# Altium schematic sheet MCH_FPGA_Power.SchDoc: Metlino
size 420 x 297 mm; CheckedBy: P.Kulik,T.Przywozki,W.Ruclo; Author: G.Kasprowicz; CompanyName: WUT ISE; DrawnBy: G.Kasprowicz; Organization: WUT ISE; Address1: PW ISE; Address2: Nowowiejska 15/19 00-665 Warsaw; Address3: gkasprow@gmail.com; DocumentNumber: 9; Revision: 2; SheetNumber: 9; SheetTotal: 29; ModifiedBy: -; CheckedDate: -; Title2: FPGA power rails; DivGrp: WUT ISE; Designer: G.Kasprowicz; ModifiedDate: -; ProjectName: Sensor Box
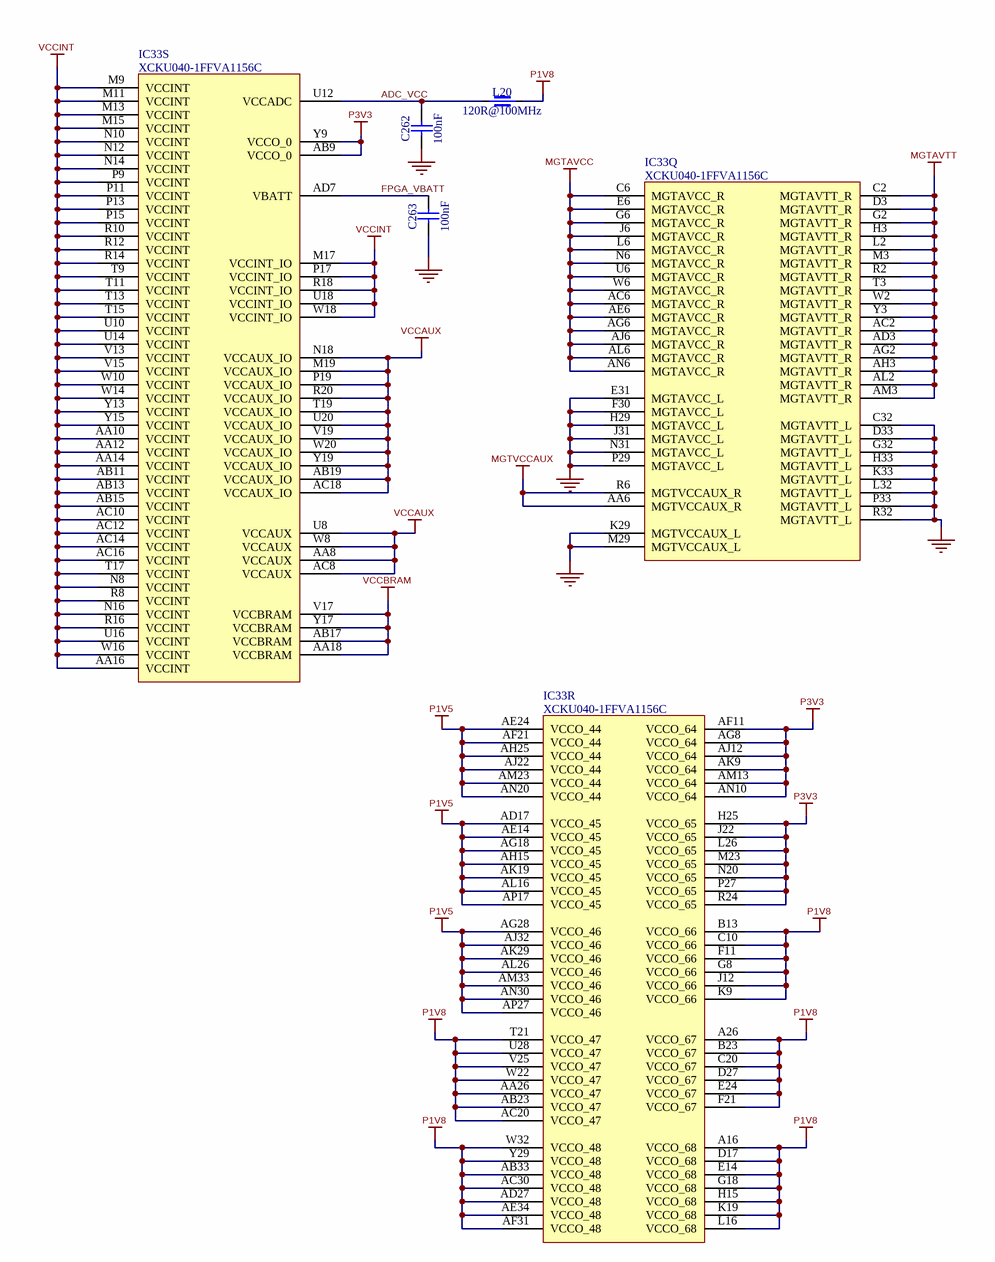
[diagram p0: MCH_FPGA_Power.SchDoc]

## Parts
C262  100nF  [CAPC0603X33N]
C263  100nF  [CAPC0603X33N]
IC33  XCKU040-1FFVA1156C  [BGA1156C100P34X34_3500X3500X350]  (parts Q,R,S of 22)
L20  120R@100MHz  [INDC1005X55N]

## Nets
GND: C262.1 C263.1 IC33.C32(MGTAVTT_L) IC33.D33(MGTAVTT_L) IC33.E31(MGTAVCC_L) IC33.F30(MGTAVCC_L) IC33.G32(MGTAVTT_L) IC33.H29(MGTAVCC_L) IC33.H33(MGTAVTT_L) IC33.J31(MGTAVCC_L) IC33.K29(MGTVCCAUX_L) IC33.K33(MGTAVTT_L) IC33.L32(MGTAVTT_L) IC33.M29(MGTVCCAUX_L) IC33.N31(MGTAVCC_L) IC33.P29(MGTAVCC_L) IC33.P33(MGTAVTT_L) IC33.R32(MGTAVTT_L)
MGTAVCC: IC33.AC6(MGTAVCC_R) IC33.AE6(MGTAVCC_R) IC33.AG6(MGTAVCC_R) IC33.AJ6(MGTAVCC_R) IC33.AL6(MGTAVCC_R) IC33.AN6(MGTAVCC_R) IC33.C6(MGTAVCC_R) IC33.E6(MGTAVCC_R) IC33.G6(MGTAVCC_R) IC33.J6(MGTAVCC_R) IC33.L6(MGTAVCC_R) IC33.N6(MGTAVCC_R) IC33.U6(MGTAVCC_R) IC33.W6(MGTAVCC_R)
MGTAVTT: IC33.AC2(MGTAVTT_R) IC33.AD3(MGTAVTT_R) IC33.AG2(MGTAVTT_R) IC33.AH3(MGTAVTT_R) IC33.AL2(MGTAVTT_R) IC33.AM3(MGTAVTT_R) IC33.C2(MGTAVTT_R) IC33.D3(MGTAVTT_R) IC33.G2(MGTAVTT_R) IC33.H3(MGTAVTT_R) IC33.L2(MGTAVTT_R) IC33.M3(MGTAVTT_R) IC33.R2(MGTAVTT_R) IC33.T3(MGTAVTT_R) IC33.W2(MGTAVTT_R) IC33.Y3(MGTAVTT_R)
MGTVCCAUX: IC33.AA6(MGTVCCAUX_R) IC33.R6(MGTVCCAUX_R)
P1V5: IC33.AD17(VCCO_45) IC33.AE14(VCCO_45) IC33.AE24(VCCO_44) IC33.AF21(VCCO_44) IC33.AG18(VCCO_45) IC33.AG28(VCCO_46) IC33.AH15(VCCO_45) IC33.AH25(VCCO_44) IC33.AJ22(VCCO_44) IC33.AJ32(VCCO_46) IC33.AK19(VCCO_45) IC33.AK29(VCCO_46) IC33.AL16(VCCO_45) IC33.AL26(VCCO_46) IC33.AM23(VCCO_44) IC33.AM33(VCCO_46) IC33.AN20(VCCO_44) IC33.AN30(VCCO_46) IC33.AP17(VCCO_45) IC33.AP27(VCCO_46)
P1V8: IC33.A16(VCCO_68) IC33.A26(VCCO_67) IC33.AA26(VCCO_47) IC33.AB23(VCCO_47) IC33.AB33(VCCO_48) IC33.AC20(VCCO_47) IC33.AC30(VCCO_48) IC33.AD27(VCCO_48) IC33.AE34(VCCO_48) IC33.AF31(VCCO_48) IC33.B13(VCCO_66) IC33.B23(VCCO_67) IC33.C10(VCCO_66) IC33.C20(VCCO_67) IC33.D17(VCCO_68) IC33.D27(VCCO_67) IC33.E14(VCCO_68) IC33.E24(VCCO_67) IC33.F11(VCCO_66) IC33.F21(VCCO_67) IC33.G8(VCCO_66) IC33.G18(VCCO_68) IC33.H15(VCCO_68) IC33.J12(VCCO_66) IC33.K9(VCCO_66) IC33.K19(VCCO_68) IC33.L16(VCCO_68) IC33.T21(VCCO_47) IC33.U28(VCCO_47) IC33.V25(VCCO_47) IC33.W22(VCCO_47) IC33.W32(VCCO_48) IC33.Y29(VCCO_48) L20.2
P3V3: IC33.AB9(VCCO_0) IC33.AF11(VCCO_64) IC33.AG8(VCCO_64) IC33.AJ12(VCCO_64) IC33.AK9(VCCO_64) IC33.AM13(VCCO_64) IC33.AN10(VCCO_64) IC33.H25(VCCO_65) IC33.J22(VCCO_65) IC33.L26(VCCO_65) IC33.M23(VCCO_65) IC33.N20(VCCO_65) IC33.P27(VCCO_65) IC33.R24(VCCO_65) IC33.Y9(VCCO_0)
VCCAUX: IC33.AA8(VCCAUX) IC33.AB19(VCCAUX_IO) IC33.AC8(VCCAUX) IC33.AC18(VCCAUX_IO) IC33.M19(VCCAUX_IO) IC33.N18(VCCAUX_IO) IC33.P19(VCCAUX_IO) IC33.R20(VCCAUX_IO) IC33.T19(VCCAUX_IO) IC33.U8(VCCAUX) IC33.U20(VCCAUX_IO) IC33.V19(VCCAUX_IO) IC33.W8(VCCAUX) IC33.W20(VCCAUX_IO) IC33.Y19(VCCAUX_IO)
VCCBRAM: IC33.AA18(VCCBRAM) IC33.AB17(VCCBRAM) IC33.V17(VCCBRAM) IC33.Y17(VCCBRAM)
VCCINT: IC33.AA10(VCCINT) IC33.AA12(VCCINT) IC33.AA14(VCCINT) IC33.AA16(VCCINT) IC33.AB11(VCCINT) IC33.AB13(VCCINT) IC33.AB15(VCCINT) IC33.AC10(VCCINT) IC33.AC12(VCCINT) IC33.AC14(VCCINT) IC33.AC16(VCCINT) IC33.M9(VCCINT) IC33.M11(VCCINT) IC33.M13(VCCINT) IC33.M15(VCCINT) IC33.M17(VCCINT_IO) IC33.N8(VCCINT) IC33.N10(VCCINT) IC33.N12(VCCINT) IC33.N14(VCCINT) IC33.N16(VCCINT) IC33.P9(VCCINT) IC33.P11(VCCINT) IC33.P13(VCCINT) IC33.P15(VCCINT) IC33.P17(VCCINT_IO) IC33.R8(VCCINT) IC33.R10(VCCINT) IC33.R12(VCCINT) IC33.R14(VCCINT) IC33.R16(VCCINT) IC33.R18(VCCINT_IO) IC33.T9(VCCINT) IC33.T11(VCCINT) IC33.T13(VCCINT) IC33.T15(VCCINT) IC33.T17(VCCINT) IC33.U10(VCCINT) IC33.U14(VCCINT) IC33.U16(VCCINT) IC33.U18(VCCINT_IO) IC33.V13(VCCINT) IC33.V15(VCCINT) IC33.W10(VCCINT) IC33.W14(VCCINT) IC33.W16(VCCINT) IC33.W18(VCCINT_IO) IC33.Y13(VCCINT) IC33.Y15(VCCINT)
ADC_VCC: C262.2 IC33.U12(VCCADC) L20.1
FPGA_VBATT: C263.2 IC33.AD7(VBATT)

## Notes on the sheet
- Project/Equipment
- Document
- Designer
- Drawn by
- Check.by
- Copyright WUT ISE 2018.
  This documentation describes Open Hardware and is licensed under the CERN OHL v.1.1. You may redistribute and modify this documentation under the terms of the CERN OHL v.1.1. (http://ohwr.org/CERNOHL). This documentation is distributed WITHOUT ANY EXPRESS OR IMPLIED WARRANTY, INCLUDING OF MERCHANTABILITY, SATISFACTORY QUALITY AND FITNESS FOR A PARTICULAR PURPOSE. Please see the CERN OHL v.1.1 for applicable conditions.
- Contact
- File
- Last Mod.
- Print Date
- Sheet
- Size
- A3
- of
- Rev

## Library data of the parts
C262 C263 = CC0201_100NF_6.3V_10%_X5R: Non-polarised capacitor; Manufacturer: GENERIC; Part Description: SMD Multilayer Chip Ceramic Capacitor; Manufacturer1 Part Number: 02016D104KAT2A; Tolerance: ±10%; Voltage: 6.3V; TC: X5R; Manufacturer Part Number: CC0201_100NF_6.3V_10%_X5R; Part Number: CC0201_100NF_6.3V_10%_X5R; Value: 100nF; Component Kind: Standard; Component Type: Standard; Pin Count: 2; Status: Not Recommended; Case: 0201; Mounted: Yes; Socket: No; SMD: Yes; Sense: No; Manufacturer1 Example: AVX; Manufacturer1 ComponentHeight: 0.33mm; HelpURL: \\cern.ch\dfs\Applications\Altium\Datasheets\CC0201_X5R_AVX.pdf; Author: CERN DEM JLC; CreateDate: 03.12.2007; LatestRevisionDate: 03.12.2007
IC33 = XCKU040-1FFVA1156C: Kintex UltraScale FPGA, 520 I/O, 530K Cells, 1156-Ball BGA, Speed Grade 1, Commercial Grade; Manufacturer: XILINX; Part Description: Kintex UltraScale, 40 DLL I/O, 416 HP I/O, 104 HR I/O, 1156-Pin BGA, Speed Grade 1, Commercial Grade; PressFit: No; Bonding: No; PackageDescription: BGA, 1.00mm Pitch, Square; 1156 Pin, 34 Columns X 34 Rows, Body 35.00mm X 35.00mm X 3.50mm H, IPC Medium Density; Part Number: XCKU040-1FFVA1156C; Component Kind: Standard; Component Type: Standard; Device: XCKU040-1FFVA1156C; Manufacturer Part Number: XCKU040-1FFVA1156C; Pin Count: 1156; Case: BGA1156; Mounted: Yes; Socket: No; SMD: Yes; Sense: No; ComponentHeight: 3.5mm; HelpURL: \\cern.ch\dfs\Applications\Altium\Datasheets\XCKU040-1FFVA1156C.pdf; ComponentLink1URL: \\cern.ch\dfs\Applications\Altium\Datasheets\XCKU040-1FFVA1156C_Package-Pinout.pdf; ComponentLink1Description: Package/Pinout; Author: CERN DEM CA; CreateDate: 16.08.2016; LatestRevisionDate: 16.08.2016
L20 = IND0402_MURATA_BLM15PX121SN1D: Manufacturer: MURATA; Part Description: SMD EMIFIL Chip Ferrite Bead; Tolerance: ±25%; Power: 2A; Resistance: 0.055R; Manufacturer Part Number: BLM15PX121SN1D; Part Number: IND0402_MURATA_BLM15PX121SN1D; Value: 120R@100MHz; Component Kind: Standard; Component Type: Standard; Pin Count: 2; Status: None; Case: 0402; Mounted: Yes; Socket: No; SMD: Yes; Sense: No; ComponentHeight: 0.55mm; HelpURL: \\cern.ch\dfs\Applications\Altium\Datasheets\IND0402_MURATA_BLM15PX.pdf; Author: CERN DEM JMW; CreateDate: 19.02.2014; LatestRevisionDate: 25.10.2018